# Altium schematic sheet [8]-GSM_MODEM_CONNECTORS.SchDoc
size A4
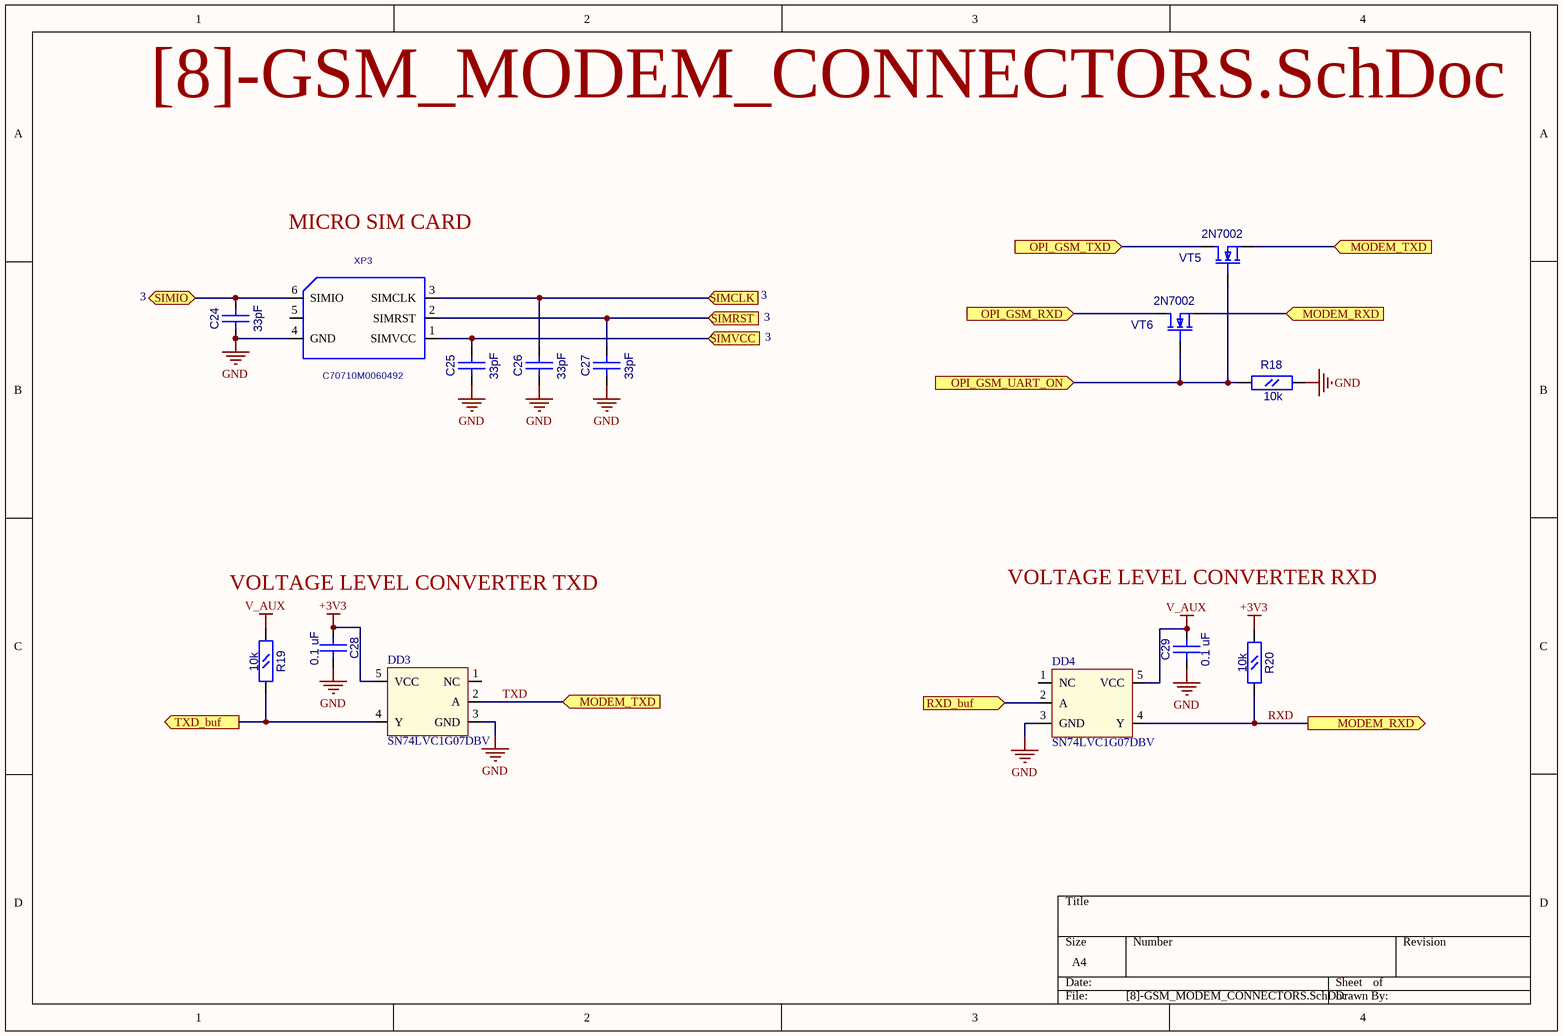
[diagram p0: [8]-GSM_MODEM_CONNECTORS.SchDoc]

## Parts
C24  33pF  [CC0603]
C25  33pF  [CC0603]
C26  33pF  [CC0603]
C27  33pF  [CC0603]
C28  0.1 uF  [CC0603]
C29  0.1 uF  [CC0603]
DD3  SN74LVC1G07DBV  [SOT23-5]
DD4  SN74LVC1G07DBV  [SOT23-5]
R18  10k  [RC0603]
R19  10k  [RC0603]
R20  10k  [RC0603]
VT5  2N7002  [SOT-23(123)]
VT6  2N7002  [SOT-23(123)]
XP3  C70710M0060492  [SCVW06A25020]

## Ports
MODEM_RXD (in), MODEM_RXD (out), MODEM_TXD (in), OPI_GSM_RXD (in), OPI_GSM_TXD (in), OPI_GSM_UART_ON (in), RXD_buf (in), SIMCLK (in), SIMIO (bidir), SIMRST (in), SIMVCC (in), TXD_buf (out)

## Nets
+3V3: C28.2(B) DD3.5(VCC) R20.1(A)
GND: C24.1(A) C25.1(A) C26.1(A) C27.1(A) C28.1(A) C29.1(A) DD3.3(GND) DD4.3(GND) R18.2(B) XP3.4(GND)
V_AUX: C29.2(B) DD4.5(VCC) R19.1(A)
OPI_GSM_RXD: VT6.3(D) ; port OPI_GSM_RXD
OPI_GSM_TXD: VT5.3(D) ; port OPI_GSM_TXD
OPI_GSM_UART_ON: R18.1(A) VT5.1(G) VT6.1(G) ; port OPI_GSM_UART_ON
RXD: DD4.4(Y) R20.2(B) VT6.2(S) ; port MODEM_RXD
RXD_buf: DD4.2(A) ; port RXD_buf
SIMCLK: C26.2(B) XP3.3(SIMCLK) ; port SIMCLK
SIMIO: C24.2(B) XP3.6(SIMIO) ; port SIMIO
SIMRST: C27.2(B) XP3.2(SIMRST) ; port SIMRST
SIMVCC: C25.2(B) XP3.1(SIMVCC) ; port SIMVCC
TXD: DD3.2(A) VT5.2(S) ; port MODEM_TXD
TXD_buf: DD3.4(Y) R19.2(B) ; port TXD_buf

Not connected (* = marked no-connect by the designer): DD3 1(NC); DD4 1(NC); XP3 5

## Notes on the sheet
- MICRO SIM CARD
- 3
- VOLTAGE LEVEL CONVERTER RXD
- VOLTAGE LEVEL CONVERTER TXD

## Library data of the parts
C24-C29 = CC0603
  C24-C27: Value: 33pF
  C28 C29: Value: 0.1 uF
DD3 DD4 = SN74LVC1G07DBV: Open Drain Single Bus Bufer
R18-R20 = RC0603: Value: 10k
VT5 VT6 = 2N7002: N-Channel Enhancement Mode Vertical DMOS FET; OriginalName: 2N7002; Value: *
XP3 = SCV-W06A25-020: Value: *